# Altium schematic sheet temperatuursmeting.SchDoc: Temperatuursmeting
size A4; DrawnBy: Jasper Maes; DocumentNumber: 4; Revision: /; SheetNumber: 4; SheetTotal: 4
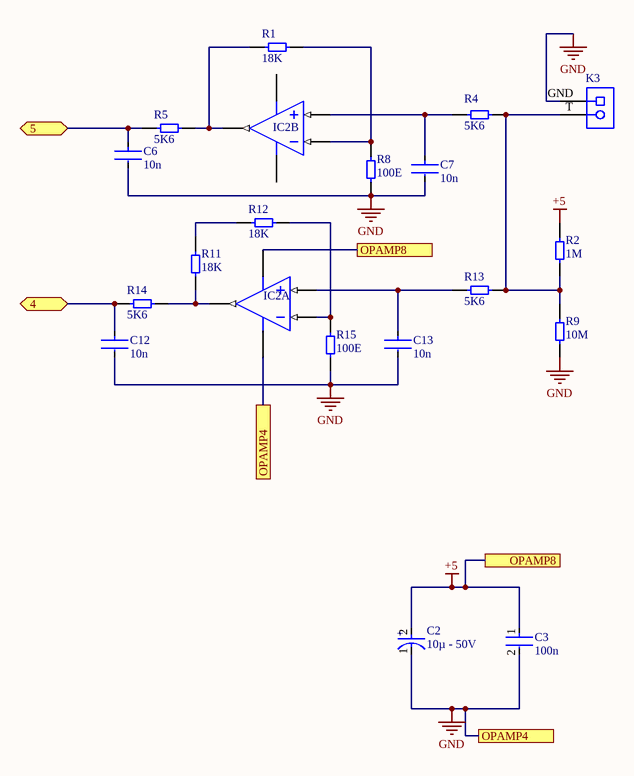
[diagram p0: temperatuursmeting.SchDoc]

## Parts
C2  10µ - 50V  [CAPPRD200W52D525H1200]
C3  100n  [FP-C0805C-DN-IPC_A]
C6  10n  [FP-C0805C-DN-IPC_A]
C7  10n  [FP-C0805C-DN-IPC_A]
C12  10n  [FP-C0805C-DN-IPC_A]
C13  10n  [FP-C0805C-DN-IPC_A]
IC2  MCP6002-E/P  [PDIP300-P8]  (value not drawn)  (parts A,B of 2)
K3  1729128  [PHOE-1729128-2_V]  (value not drawn)
R1  18K  [RESC2013X60X40ML20T25]
R2  1M  [RESC2013X60X40ML20T25]
R4  5K6  [RESC2013X60X40ML20T25]
R5  5K6  [RESC2013X60X40ML20T25]
R8  100E  [RESC2013X60X40ML20T25]
R9  10M  [RESC2013X60X40ML20T25]
R11  18K  [RESC2013X60X40ML20T25]
R12  18K  [RESC2013X60X40ML20T25]
R13  5K6  [RESC2013X60X40ML20T25]
R14  5K6  [RESC2013X60X40ML20T25]
R15  100E  [RESC2013X60X40ML20T25]

## Ports
4 (bidir, see Main_IC_Sheet[3B]), 5 (bidir, see Main_IC_Sheet[3B]), OPAMP4 (see temperatuursmeting[2C]), OPAMP4 (see temperatuursmeting[3D]), OPAMP8 (see temperatuursmeting[2B]), OPAMP8 (see temperatuursmeting[3C])

## Nets
+5: C2.2(A) C3.1 IC2.4(VSS) R2.1 ; port OPAMP8
GND: C2.1(C) C3.2 C6.2 C7.2 C12.2 C13.2 IC2.8(VDD) K3.GND R8.2 R9.2 R15.2 ; port OPAMP4
4: C12.1 R14.1 ; port 4
5: C6.1 R5.1 ; port 5
NetC7_1: C7.1 IC2.5(VINB+) R4.1
NetC13_1: C13.1 IC2.3(VINA+) R13.1
NetIC2_1: IC2.1(VOUTA) R11.2 R14.2
NetIC2_2: IC2.2(VINA-) R12.2 R15.1
NetIC2_6: IC2.6(VINB-) R1.2 R8.1
NetIC2_7: IC2.7(VOUTB) R1.1 R5.2
NetK3_T: K3.T R2.2 R4.2 R9.1 R13.2
NetR11_1: R11.1 R12.1

## Notes on the sheet
- (in symbol CMP-05427-000897-1) +

## Library data of the parts
C2 = CMP-05427-000897-1: Aluminum Electrolytic Capacitors (Radial Lead Type) 100uF ±20% 25V; ESR (Equivalent Series Resistance): 130mR; Ripple Current: 455mA; Polarity: Polar; Life (Hours): 2000Hour; Lead Diameter: 0.5mm; Tolerance: 20%; Radiation Hardening: No; Min Operating Temperature: -40°C; Series: FR; Max Operating Temperature: 105°C; Lead Free: Lead Free; Package Quantity: 2000; Capacitance: 100uF; Lead Pitch: 5mm; Voltage Rating (DC): 25V; Length: 11.2mm; Features: General Purpose; Mount: Through Hole; Voltage Rating: 25V; Case/Package: Radial; Impedance: 130mR; RoHS Compliant: Yes; Packaging: Tape and Reel; Height - Seated (Max): 0.441inch; Height: 11.2mm; Diameter: 6.3mm; Termination: Radial
C3 C6 C7 C12 C13 = CMP-2007-00279-2: CAP CER 0.1UF 50V X7R 0805; Manufacturer Part Number: C0805C104K5RACTU; Manufacturer: KEMET; Value: 0.10 μF; Tolerance: 0.1; Temperature Coefficient: 30ppm/°C; Material: Ceramic; Device Class L2: Capacitors; Temperature Range Low: -55°C; Voltage Rating: 50 V; Digikey Description: CAP CER 0.1UF 50V X7R 0805; Category: Cap; ComponentLink2Description: Datasheet; Octopart: https://octopart.com/c0805c104k5ractu-kemet-143926; RoHS: TRUE; ComponentLink2URL: https://content.kemet.com/datasheets/KEM_C1003_C0G_SMD.pdf; Temperature Characteristic: X7R; Temperature: -55°C to +125°C; Height: 0.88mm; Temperature Range High: +125°C; Device Class L1: Passive Components; Automotive: No; Lead Free: Yes; Ipc Land Pattern Name: CAPC200125X78; Device Class L3: Ceramic Capacitors; Mouser Description: Cap Ceramic 0.1uF 50V X7R 10% SMD 2.0 x 1.2 mm 125 C Paper T/R; Capacitance: 0.10 μF; Package: C0805C-DN
IC2 = CMP-0187-00133-3: None; Slew Rate: 0.6V/µs; Supply Current: 100uA; Power Supply Rejection Ratio (PSRR): 86dB; Input Offset Voltage (Vos): 4.5mV; Input Bias Current: 1pA; Amplifier Type: GENERAL PURPOSE; Unity Gain Bandwidth Product: 1MHz; Number of Circuits: 2; Output Current: 23mA; Operating Supply Voltage: 5.5V; Min Supply Voltage: 1.8V; Common Mode Rejection Ratio: 60dB; Voltage Gain: 112dB; Max Supply Voltage: 6V; Package Quantity: 60; REACH SVHC: No SVHC; Min Operating Temperature: -40°C; Max Operating Temperature: 125°C; Mount: Through Hole; Nominal Supply Current: 100uA; Height: 3.3mm; Length: 9.27mm; Slew Rate-Nom: 0.6V/µs; Packaging: Rail/Tube; Output Current per Channel: 23mA; Number of Amplifiers: 2; RoHS Compliant: Yes; Radiation Hardening: No; Bandwidth: 1MHz; Lead Free: Lead Free; Width: 6.35mm; Number of Channels: 2; Gain Bandwidth Product: 1MHz; Technology: CMOS; Operating Supply Current: 100uA; Number of Elements: 2; Number of Pins: 8; Input Offset Voltage-Max: 4.5mV; Case/Package: PDIP
K3 = CMP-2000-05815-1: PCB Terminal Block, 13.5 A, 400 V, 2-Pin THD, RoHS, Bulk; Manufacturer: Phoenix Contact; Package Version: 03/2015; No. of Rows: 1; Pitch: 5.08mm; No. of Positions: 2; Voltage Rating: 400V; Current Rating: 13500mA; Manufacturer URL: http://www.phoenixcontact.com/; Datasheet URL: https://datasheet.ciiva.com/16046/1729128-16046181.pdf; RoHS: TRUE; Package URL: https://www.phoenixcontact.com/online/portal/pi/pxc/product_detail_page/!ut/p/b1/3VdJjqNKFDxLH8AFycySyWY2ozFsEPOMMQaDOX1XedGL_1Vdm5YXJleknhSKeBkvI6EA8ncAo3AYoDhBQGco6KN7VURTdemj9us_IEKEZo_YHiPAEWEFmDGOHMORkqKYCORBZxgL7ZoaZYcbFFUZ3fqxSY6GOuxydWUuHqz1ynmMFygu583Bob0Ewr6Sd_l-5m-kAueHiB0jpRwZwe58wwtkpxtMYd_LmGcDRU02dRNEyWt6Y2ti5pSyJ_reIkzIulrqApdnbT11V5jnCKbYNCvhEM1MCpPByat_X379-iThf08CI5GfOPqfBeS3BRoBOdD55AKVv0iLwCMq-2BrzXWSGRH7pUGD9uwXQjiph3xL0DKQwdGa0JImiIOmBNOestqgwTHSSs2oOep-78apyXQBvNi8ZLaFjvjWvcaUEBu0MC6Wbe-d6mB0FAebo2lUWinqYaZs5DAYzV0RP9yitUjnGJ0iI9xhZkT42OCQNUJJhkgWINNQLP2JFP6OpMg3JCVg70jqHT0lvKOnhHf0lPuOnnLf0VPuWx6_dxwUIvwk5WMkT0kLL1mh61l2yZVSzG3pYV_bqo-mj6uMKwKwdnnW8Jh5RTOJzMOA5c-eJDaZQw4mTMPH02PvS_ZAqNVjVTo2WyYLkwH_KU1mmmG5kjRhDqPXLwwVHvVOjCM60-fpXvTDfMGW1PVFVS1r4e4yVDk4ZdNbkUHvqPqQSeian4UD39fNKmachqdJ1NJbyk8rXT9mXTvPk3oE5meulKGgiruPJek-4I9hTT6G8ZLOyRSm2RRVbThERQad5OS28hdt4YW4vG0stgYYzsWsK4_7y6DZMjJSCqri1kyiZR5vD7pwIrNR7QwPHTcLTI5qT7eRlpHrdGiupYlqQDJ7zy_CND8fWWBoLRXxk1RVcXiBQwbTD4Xi7KL-FuO94t9xaqweXzH; PartNumber: 1729128; Package Description: 2-Pin Through Hole Device, Body 8.1 x 10.16 mm, Pitch 5.08 mm; Datasheet Version: 12/2013; Mounting Technology: ThroughHole; Orientation: Horizontal; Package Reference: 1729128-2; Packing: Bulk
R1 R2 R4 R5 R8 R9 R11-R15 = CMP-2001-00629-1_1: Part Number: ERA6AEB332V; Manufacturer: Panasonic